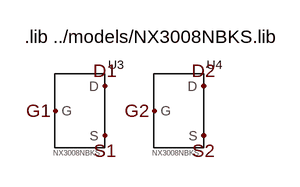
[diagram p0: schematic NX3008NBKS_pair.asc]
NX3008NBKS_pair.asc, the LTspice schematic file:
Version 4.1
SHEET 1 880 680
FLAG 160 128 G1
FLAG 288 128 G2
FLAG 224 96 D1
FLAG 352 96 D2
FLAG 224 160 S1
FLAG 352 160 S2
SYMBOL NX3008NBKS 320 160 R0
SYMATTR InstName U3
SYMBOL NX3008NBKS 448 160 R0
SYMATTR InstName U4
TEXT 120 32 Left 2 !.lib ../models/NX3008NBKS.lib

The netlist it stands for:
* NX3008NBKS_pair.asc
X§U3 D1 G1 S1 NX3008NBKS  ; pins D G S
X§U4 D2 G2 S2 NX3008NBKS  ; pins D G S
.lib ../models/NX3008NBKS.lib
.backanno
.end